# EAGLE design motor_controller (EAGLE 9.6.2)
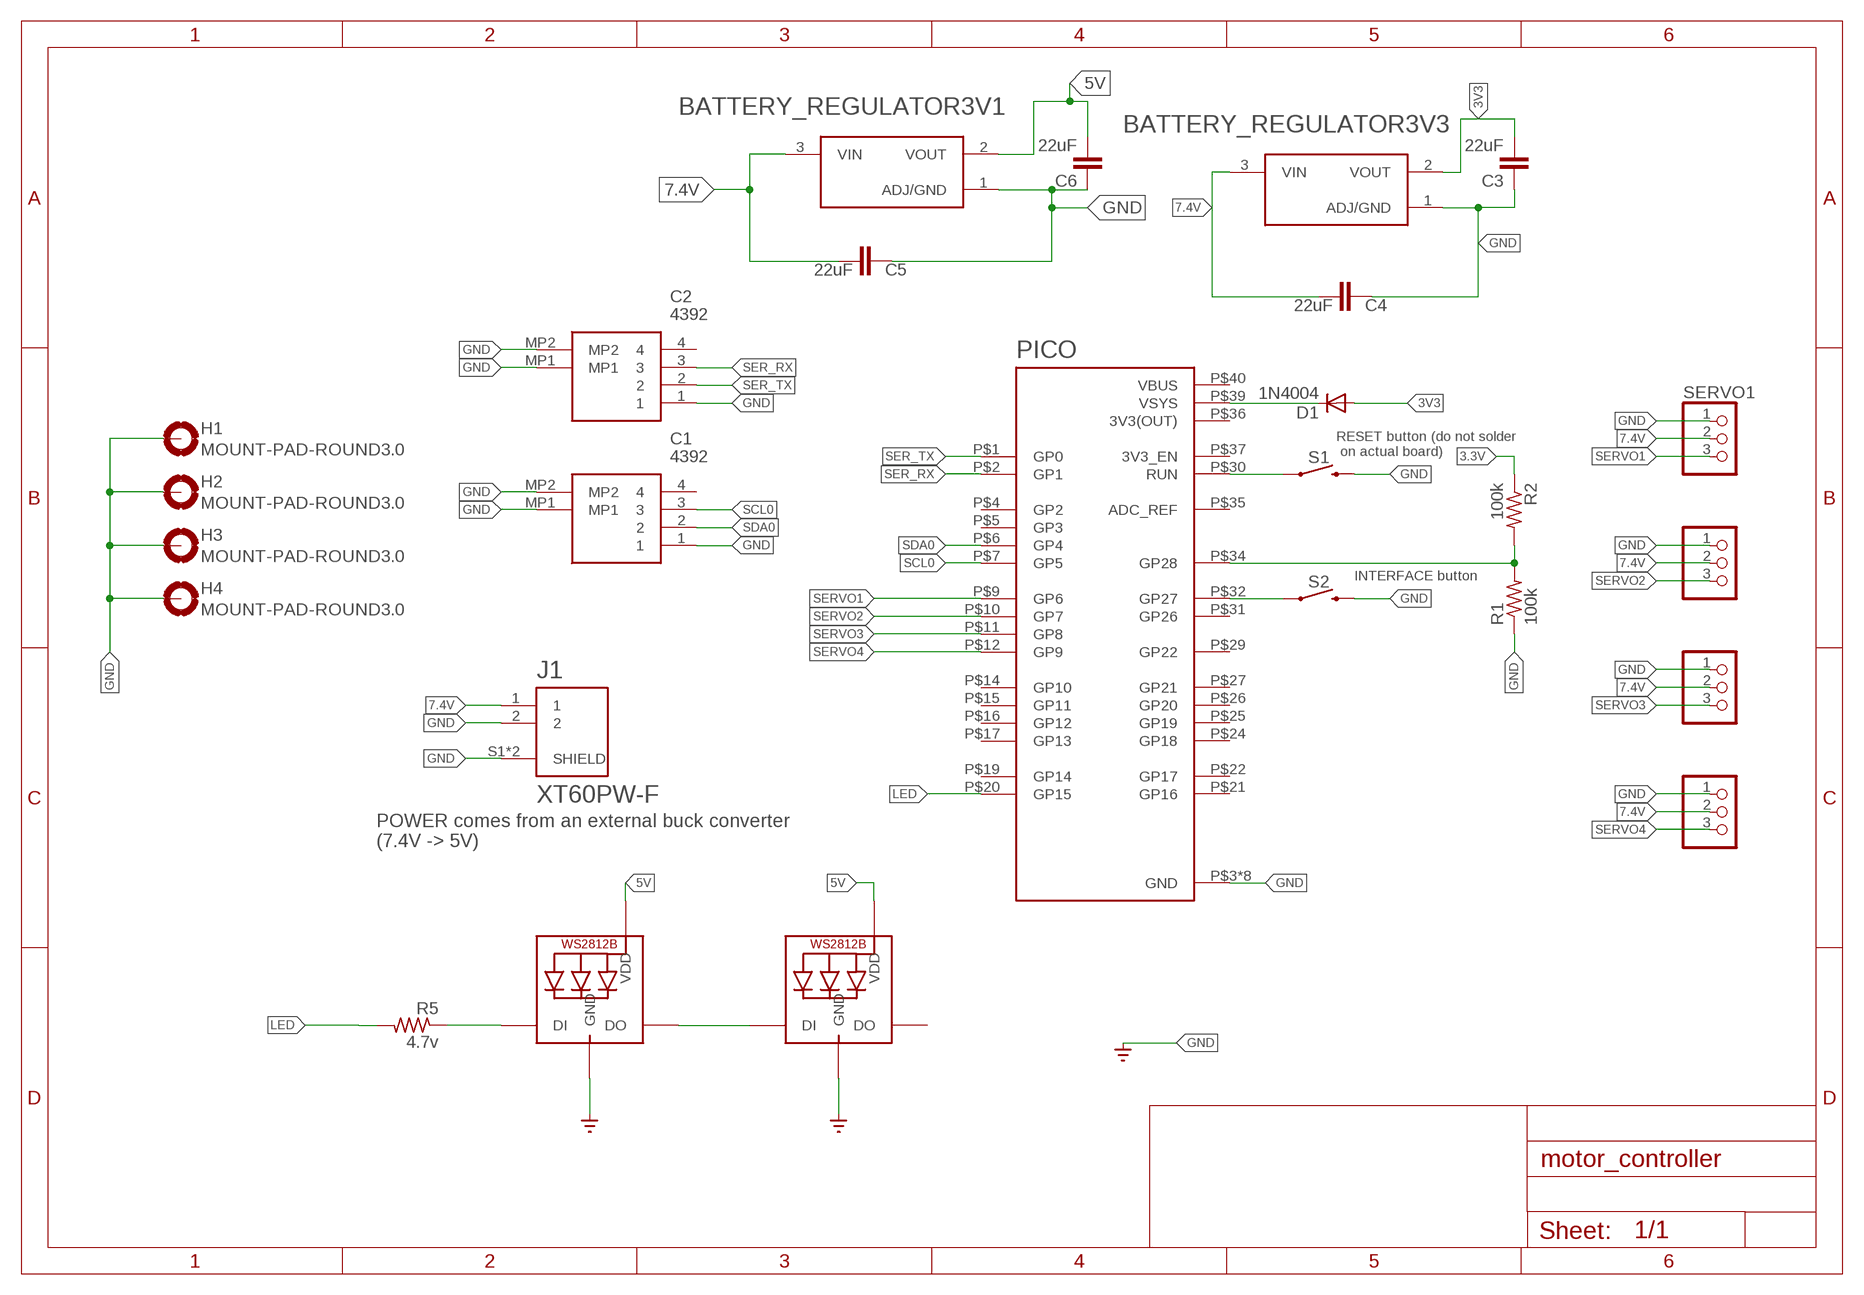
[diagram p0: schematic, sheet 1]

## Parts
BATTERY_REGULATOR3V1  AMS1117-3.3  [SOT229P700X180-4N]
BATTERY_REGULATOR3V3  AMS1117-3.3  [SOT229P700X180-4N]
C1  4392  [4392]
C2  4392  [4392]
C3  22uF  22UF-0805-6.3V-20%  [0805]
C4  22uF  22UF-0805-6.3V-20%  [0805]
C5  22uF  22UF-0805-6.3V-20%  [0805]
C6  22uF  22UF-0805-6.3V-20%  [0805]
D1  1N4004  [DO41-10]
H1  MOUNT-PAD-ROUND3.0  [3,0-PAD]
H2  MOUNT-PAD-ROUND3.0  [3,0-PAD]
H3  MOUNT-PAD-ROUND3.0  [3,0-PAD]
H4  MOUNT-PAD-ROUND3.0  [3,0-PAD]
J1  XT60PW-F  [AMASS_XT60PW-F]
LED1  WS2812B3535  [LED3535]
LED2  WS2812B3535  [LED3535]
PICO  RASPBERRY_PICO-NO_DEBUG  [PICO-PKG-NO_DEBUG]
R1  100k  R-US_R0805  [R0805]
R2  100k  R-US_R0805  [R0805]
R5  4.7v  R-US_R0805  [R0805]
S1  MOMENTARY-SWITCH-SPST-PTH-6.0MM  [TACTILE_SWITCH_PTH_6.0MM]
S2  MOMENTARY-SWITCH-SPST-PTH-6.0MM  [TACTILE_SWITCH_PTH_6.0MM]
SERVO1  PINHD-1X3  [1X03]
SERVO2  PINHD-1X3  [1X03]
SERVO3  PINHD-1X3  [1X03]
SERVO4  PINHD-1X3  [1X03]

## Nets
3.3V: R2.1
3V3: BATTERY_REGULATOR3V3.2(VOUT) C3.2 D1.A
5V: BATTERY_REGULATOR3V1.2(VOUT) C6.2 LED1.2(VDD) LED2.2(VDD)
7.4V: BATTERY_REGULATOR3V1.3(VIN) BATTERY_REGULATOR3V3.3(VIN) C4.2 C5.2 J1.1 SERVO1.2 SERVO2.2 SERVO3.2 SERVO4.2
GND: BATTERY_REGULATOR3V1.1(ADJ/GND) BATTERY_REGULATOR3V3.1(ADJ/GND) C1.1 C1.MP1 C1.MP2 C2.1 C2.MP1 C2.MP2 C3.1 C4.1 C5.1 C6.1 H1.B3,0(MOUNT) H2.B3,0(MOUNT) H3.B3,0(MOUNT) H4.B3,0(MOUNT) J1.2 J1.S1(SHIELD) J1.S2(SHIELD) LED1.4(GND) LED2.4(GND) PICO.P$3(GND) PICO.P$8(GND) PICO.P$13(GND) PICO.P$18(GND) PICO.P$23(GND) PICO.P$28(GND) PICO.P$33(GND) PICO.P$38(GND) R1.1 S1.3 S2.3 SERVO1.1 SERVO2.1 SERVO3.1 SERVO4.1 ; supply symbol labelled SUPPLY0_GND_
LED: PICO.P$20(GP15) R5.2
N$1: D1.C PICO.P$39(VSYS)
N$2: PICO.P$30(RUN) S1.1
N$3: PICO.P$32(GP27) S2.1
N$4: PICO.P$34(GP28) R1.2 R2.2
N$7: LED1.3(DO) LED2.1(DI)
N$8: LED1.1(DI) R5.1
SCL0: C1.3 PICO.P$7(GP5)
SDA0: C1.2 PICO.P$6(GP4)
SER_RX: C2.3 PICO.P$2(GP1)
SER_TX: C2.2 PICO.P$1(GP0)
SERVO1: PICO.P$9(GP6) SERVO1.3
SERVO2: PICO.P$10(GP7) SERVO2.3
SERVO3: PICO.P$11(GP8) SERVO3.3
SERVO4: PICO.P$12(GP9) SERVO4.3
Unconnected: C1.4 C2.4 LED2.3(DO) PICO.P$4(GP2) PICO.P$5(GP3) PICO.P$14(GP10) PICO.P$15(GP11) PICO.P$16(GP12) PICO.P$17(GP13) PICO.P$19(GP14) PICO.P$21(GP16) PICO.P$22(GP17) PICO.P$24(GP18) PICO.P$25(GP19) PICO.P$26(GP20) PICO.P$27(GP21) PICO.P$29(GP22) PICO.P$31(GP26) PICO.P$35(ADC_REF) PICO.P$37(3V3_EN)

## Notes on the sheet
- RESET button (do not solder
   on actual board)
- INTERFACE button
- POWER comes from an external buck converter 
  (7.4V -> 5V)

## Power pins joined to a net without a drawn wire
3V3(OUT): PICO.P$36(3V3(OUT))
VBUS: PICO.P$40(VBUS)

## Library data of the parts
BATTERY_REGULATOR3V1 BATTERY_REGULATOR3V3 = AMS1117-3.3:AMS1117-3.3: Sot223/Pkg 1-Amp 3.3-Volt Low Drop Out Voltage Regulatator Check availability <https://pricing.snapeda.com/parts/AMS1117-3.3/Advanced%20Monolithic%20Systems/view-part?ref=eda>; AVAILABILITY: Not in stock; DESCRIPTION: Sot223/Pkg 1-Amp 3.3-Volt Low Drop Out Voltage Regulatator; MF: Advanced Monolithic Systems; MP: AMS1117-3.3; PACKAGE: SOT-223 Seeed Technology; PRICE: None
C1 C2 = 4392:4392: Adafruit Accessories JST PH 4-pin Horizontal Connector (10-pack) - STEMMA Source: Datasheet <https://www.mouser.dk/datasheet/2/737/4389_C13924-001_CCP-W20-03-BK-SMT-R-A-1708610.pdf>; DESCRIPTION: Adafruit Accessories JST PH 4-pin Horizontal Connector (10-pack) - STEMMA; HEIGHT: 6.85mm; MANUFACTURER_NAME: Adafruit; MANUFACTURER_PART_NUMBER: 4392; MOUSER_PART_NUMBER: 485-4392; MOUSER_PRICE-STOCK: https://www.mouser.co.uk/ProductDetail/Adafruit/4392?qs=xZ%2FP%252Ba9zWqbG2TKb%252Bnxciw%3D%3D
C3-C6 = SparkFun-Capacitors:22UF: 22µF ceramic capacitors A capacitor is a passive two-terminal electrical component used to store electrical energy temporarily in an electric field.; PROD_ID: CAP-08402
D1 = adafruit:1N4004: DIODE General purpose 1N400x type rectifier (With bigger pads) http://www.ladyada.net/library/pcb/eaglelibrary.html
H1-H4 = holes:MOUNT-PAD-ROUND: MOUNTING PAD, round
J1 = XT60PW-F:XT60PW-F: Socket DC Supply Connector Female Check availability <https://pricing.snapeda.com/parts/XT60PW-F/AMASS/view-part?ref=eda>; AVAILABILITY: Not in stock; CHECK_PRICES: https://www.snapeda.com/parts/XT60PW-F/AMASS/view-part/?ref=eda; MF: AMASS; MP: XT60PW-F; PACKAGE: Package; PRICE: None; SNAPEDA_LINK: https://www.snapeda.com/parts/XT60PW-F/AMASS/view-part/?ref=snap
LED1 LED2 = WS2812B:WS2812B: Check availability <https://pricing.snapeda.com/parts/WS2812B/Worldsemi/view-part?ref=eda>; AVAILABILITY: Not in stock; CHECK_PRICES: https://www.snapeda.com/parts/WS2812B/Worldsemi/view-part/?ref=eda; DESCRIPTION: Intelligent control LED integrated light source; MF: Worldsemi; MP: WS2812B; PACKAGE: None; PRICE: None; SNAPEDA_LINK: https://www.snapeda.com/parts/WS2812B/Worldsemi/view-part/?ref=snap
PICO = RpiPico:RASPBERRY_PICO-NO_DEBUG
R1 R2 R5 = rcl:R-US_: RESISTOR, American symbol; SPICEPREFIX: R
S1 S2 = SparkFun-Switches:MOMENTARY-SWITCH-SPST: Momentary Switch (Pushbutton) - SPST Normally-open (NO) SPST momentary switches (buttons, pushbuttons). Variants PTH-12MM - 12mm square, through-hole Momentary Pushbutton Switch - 12mm Square <https://www.sparkfun.com/products/9190> (COM-09190) PTH-6.0MM, PTH-6.0MM-KIT - 6.0mm square, through-hole Mini Pushbutton Switch <https://www.sparkfun.com/products/97> (COM-00097) KIT package intended for soldering kit's - only one side of pads' copper is exposed. PTH-RIGHT-ANGLE-KIT - Right-angle, through-hole Right Angle Tactile Button <https://www.sparkfun.com/products/10791> - Used on SparkFun BigTime Watch Kit <https://www.sparkfun.com/products/11734> SMD-12MM - 12mm square, surface-mount Tactile Button - SMD (12mm) <https://www.sparkfun.com/products/12993> (COM-12993) Used on SparkFun PicoBoard <https://www.sparkfun.com/products/11888> SMD-4.5MM - 4.5mm Square Trackball Switch Used on SparkFun Blackberry Trackballer Breakout <https://www.sparkfun.com/products/13169> SMD-4.6MMX2.8MM - 4.60mm x 2.80mm, surface mount Used on SparkFun Pro Micro - RP2040 <https://www.sparkfun.com/products/17717> SMD-5.2MM, SMD-5.2-REDUNDANT - 5.2mm square, surface-mount Mini Pushbutton Switch - SMD <https://www.sparkfun.com/products/8720> (COM-08720) Used on Arduino Pro Mini <https://www.sparkfun.com/products/11114> REDUNDANT package connects both switch circuits together SMD-6.0X3.5MM - 6.0 x 3.5mm, surface mount Momentary Reset Switch SMD <https://www.sparkfun.com/products/8229> (COM-08229) SMD-6.2MM-TALL - 6.2mm square, surface mount Tactile Button - SMD (6mm) <https://www.sparkfun.com/products/12992> Used on SparkFun Digital Sandbox <https://www.sparkfun.com/products/12651> SMD-RIGHT-ANGLE - Right-angle, surface mount Used on SparkFun Block for Intel® Edison - Arduino <https://www.sparkfun.com/products/13036>; PROD_ID: SWCH-08441; SF_SKU: COM-00097
SERVO1-SERVO4 = pinhead:PINHD-1X3: PIN HEADER

## Board
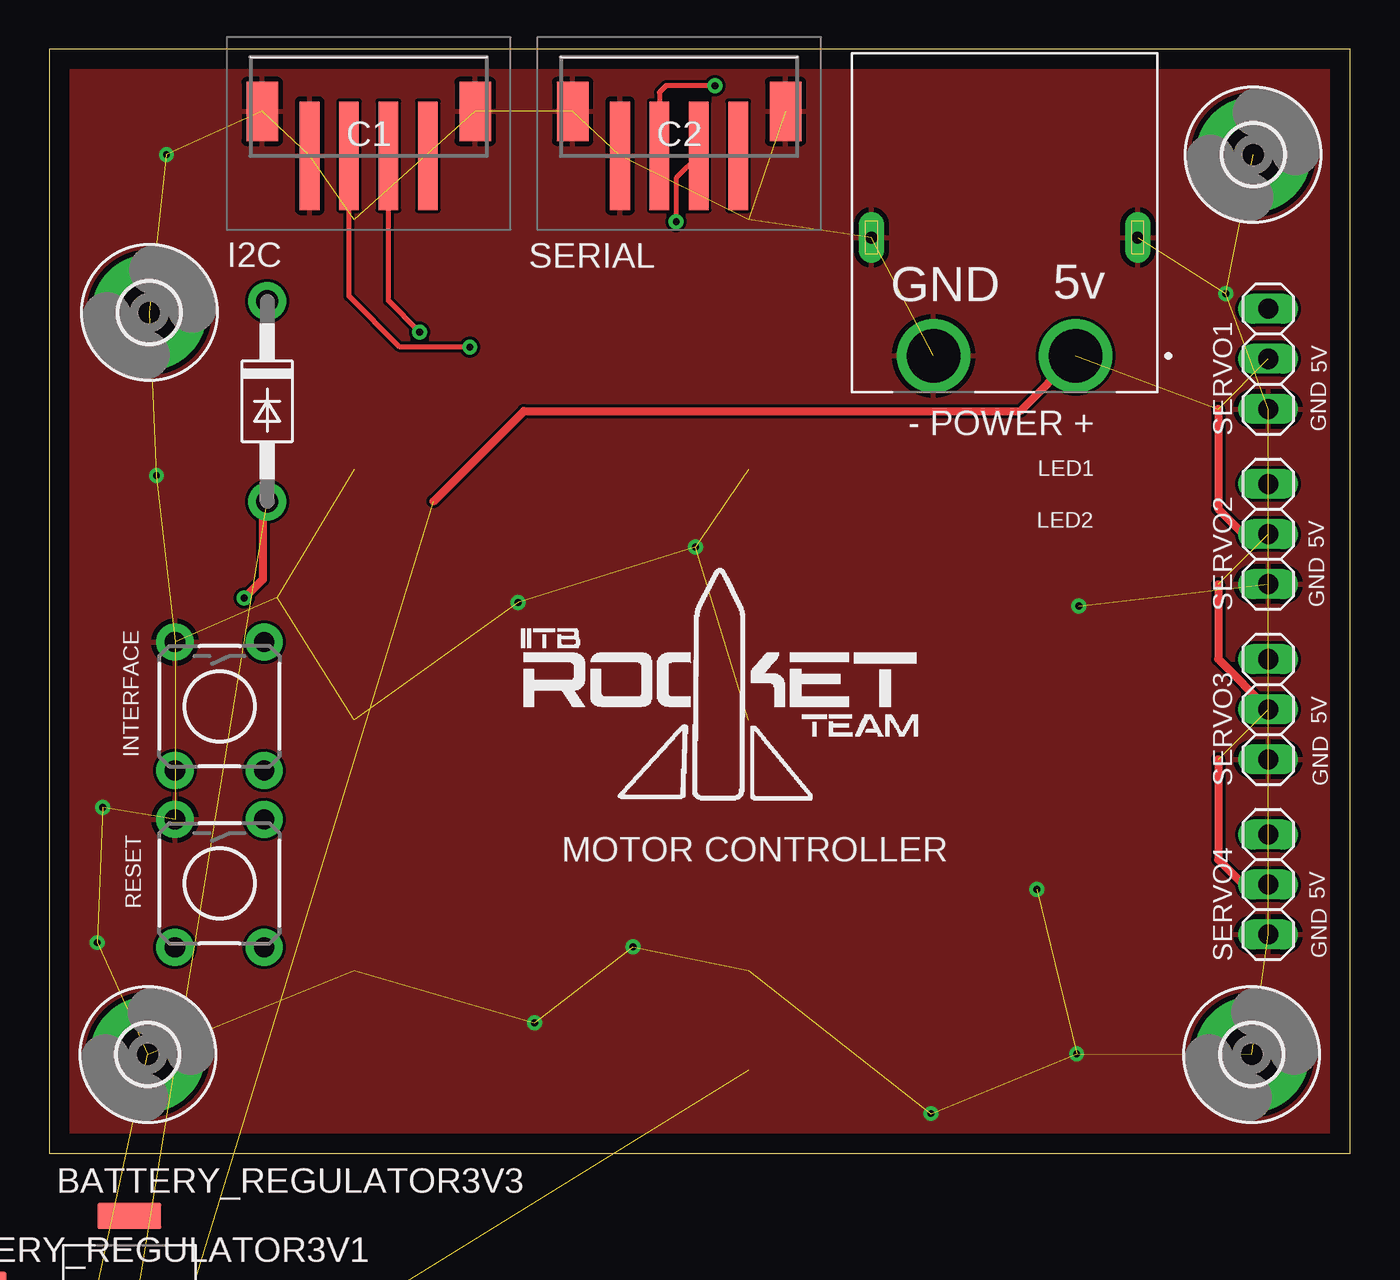
[diagram p1: board, top side]
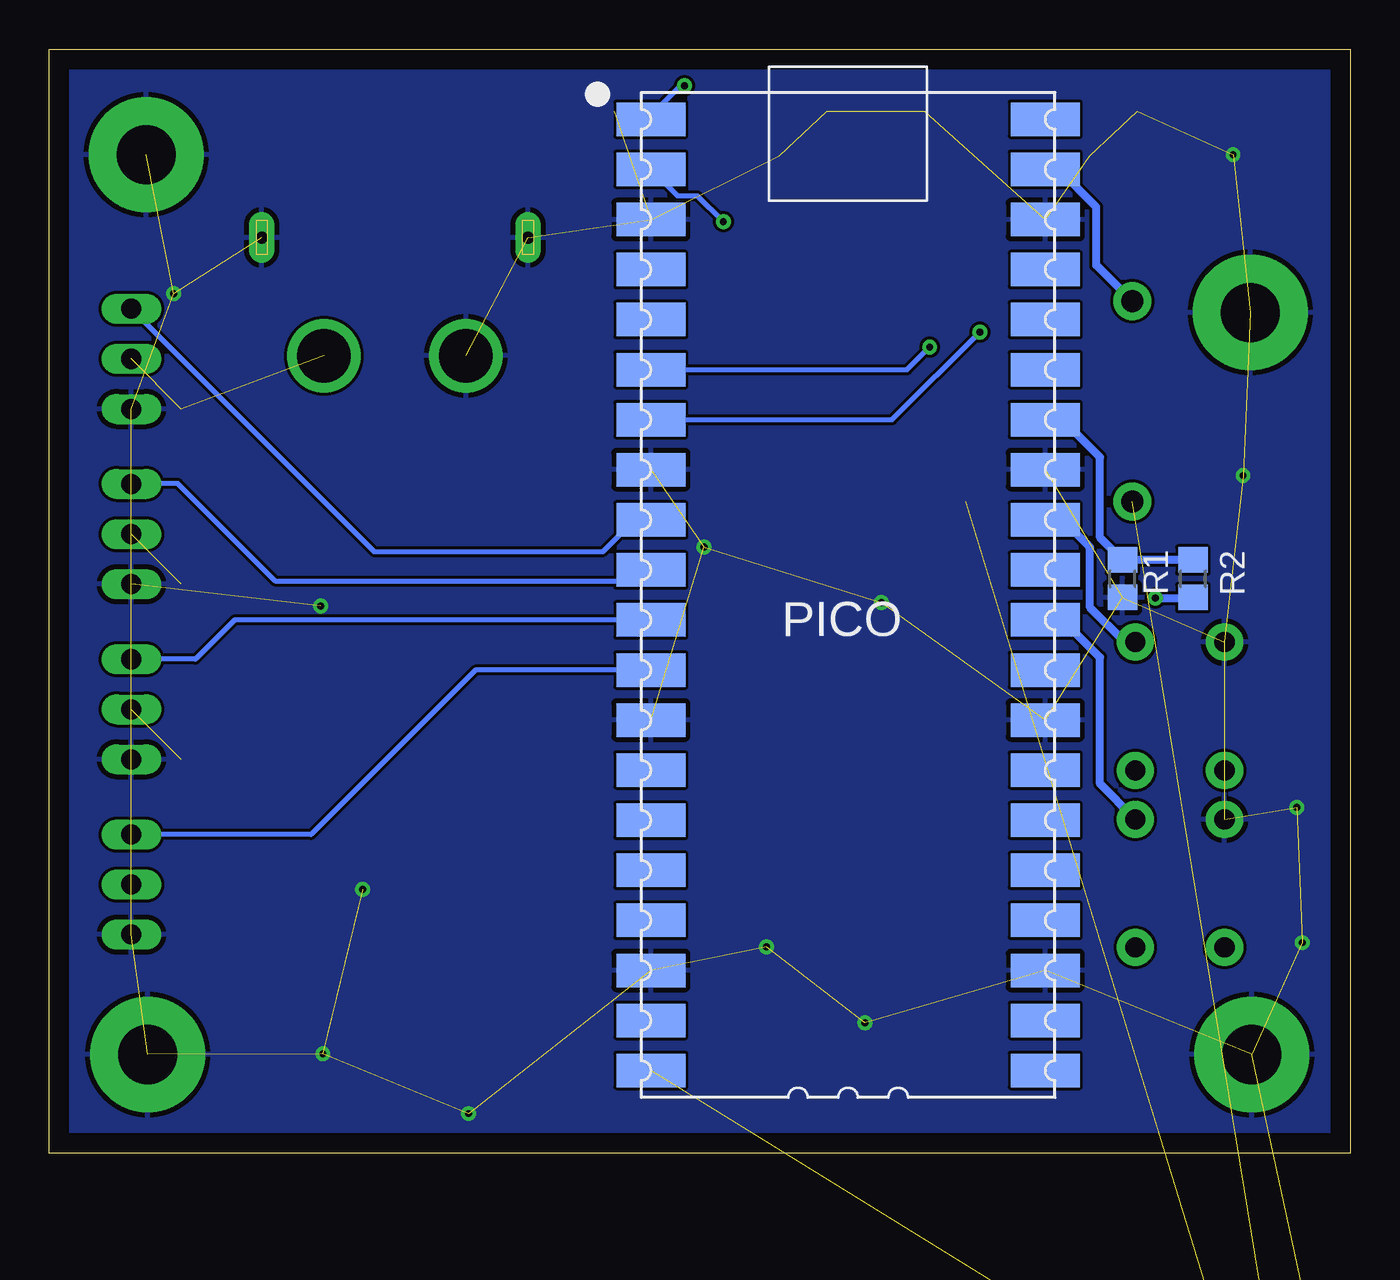
[diagram p2: board, bottom side, seen from below]

Size 66 x 56 mm. Coordinates in mm from the lower left corner, seen from the top.
Outline: 0,0 66,0 66,56 0,56 0,0
Copper layers (1*16): Top 0.035mm / dielectric 1.5mm / Bottom 0.035mm
Design rules "default": minimum track width 6mil, minimum drill 0.35mm, track to track 6mil, track to pad 6mil, pad to pad 6mil, via to via 6mil, smd to smd 6mil, copper to edge 40mil, drill to drill 6mil, minimum pad ring 10mil, minimum via ring 8mil, stop-mask expansion 4mil, vias tented up to drill 0mil, thermal gap 10mil

### Footprints (pad centres in the part's own frame; a part is rotated, then mirrored left to right if it is on the bottom)
SOT229P700X180-4N = smd 0.93 x 1.31: 1 -2.29,-3.345; 2 0,-3.345; 3 2.29,-3.345 | smd 3.24 x 1.31: 4 0,3.345
4392 = smd 1 x 5.5: 1 3,3.5; 2 1,3.5; 3 -1,3.5; 4 -3,3.5 | smd 1.6 x 3: MP1 5.4,1.25; MP2 -5.4,1.25
0805 = smd 0.8 x 1.2: 1 -0.9,0; 2 0.9,0
DO41-10 = drill 1.118 pad 1.93: A 5.08,0; C -5.08,0
3,0-PAD = drill 3 pad 5.842: B3,0 0,0
AMASS_XT60PW-F = drill 2.7: 1 -3.6,0; 2 3.6,0 | drill 0.6 pad 1.3 long: S1 -6.75,-6; S2 6.75,-6
LED3535 = smd 1 x 0.85: 1 -1.75,0.875; 2 -1.75,-0.875; 3 1.75,-0.875; 4 1.75,0.875
PICO-PKG-NO_DEBUG = smd 3.5 x 1.7: P$1 -8.73,25.4; P$2 -8.73,22.86; P$3 -8.73,20.32; P$4 -8.73,17.78; P$5 -8.73,15.24; P$6 -8.73,12.7; P$7 -8.73,10.16; P$8 -8.73,7.62; P$9 -8.73,5.08; P$10 -8.73,2.54; P$11 -8.73,0; P$12 -8.73,-2.54; P$13 -8.73,-5.08; P$14 -8.73,-7.62; P$15 -8.73,-10.16; P$16 -8.73,-12.7; P$17 -8.73,-15.24; P$18 -8.73,-17.78; P$19 -8.73,-20.32; P$20 -8.73,-22.86; P$21 11.27,-22.86; P$22 11.27,-20.32; P$23 11.27,-17.78; P$24 11.27,-15.24; P$25 11.27,-12.7; P$26 11.27,-10.16; P$27 11.27,-7.62; P$28 11.27,-5.08; P$29 11.27,-2.54; P$30 11.27,0; P$31 11.27,2.54; P$32 11.27,5.08; P$33 11.27,7.62; P$34 11.27,10.16; P$35 11.27,12.7; P$36 11.27,15.24; P$37 11.27,17.78; P$38 11.27,20.32; P$39 11.27,22.86; P$40 11.27,25.4
R0805 = smd 1.3 x 1.5: 1 -0.95,0; 2 0.95,0
TACTILE_SWITCH_PTH_6.0MM = drill 1.016 pad 1.88: 1 -3.251,2.261; 2 3.251,2.261; 3 -3.251,-2.261; 4 3.251,-2.261
1X03 = drill 1.016 long: 1 -2.54,0; 2 0,0; 3 2.54,0

### Placement (x,y rotation side)
BATTERY_REGULATOR3V1  -3.78,-10.03 0 top  (outside the outline)
BATTERY_REGULATOR3V3  4.06,-6.53 0 top  (outside the outline)
C1  16.21,54.1 180 top
C2  31.95,54.1 180 top
C3  13.44,-15.01 0 top  (outside the outline)
C4  16.51,-15.01 0 top  (outside the outline)
C5  -6.2,-18.52 0 top  (outside the outline)
C6  -6.2,-22.02 0 top  (outside the outline)
D1  11.05,38.14 270 top
H1  5.08,42.65 0 top
H2  5,5 0 top
H3  61,5 0 top
H4  61.08,50.65 0 top
J1  48.46,40.45 180 top
LED1  -10.44,-20.68 0 top  (outside the outline)
LED2  -15.29,-20.68 0 top  (outside the outline)
PICO  26.75,27.05 0 bottom
R1  11.56,29.14 90 bottom
R2  7.98,29.14 90 bottom
R5  -15.7,-26.82 0 top  (outside the outline)
S1  8.64,13.69 270 top
S2  8.64,22.67 270 top
SERVO1  61.84,40.29 90 top
SERVO2  61.84,31.4 90 top
SERVO3  61.84,22.51 90 top
SERVO4  61.84,13.62 90 top

### Tracks (layer width: path | path; a pad name or v marks a point on that pad's centre or on a via)
3.3V  (via drill 0.35)
  Top 0.406: 10.83,32.83 10.83,29.1 v9.88,28.15
  Bottom 0.406: v9.88,28.15 8.02,28.15 R2.1
3V3  (2 unrouted)
5V  (3 unrouted)
7.4V  (8 unrouted)
  Top 0.406: 19.49,33.06 24.08,37.65 49.26,37.65 J1.1 | 61.68,40.45 SERVO1.2 | SERVO2.2 60.57,31.4 59.3,32.67 59.3,37.75 | 59.3,28.86 59.3,25.05 SERVO3.2 | 59.3,19.97 59.3,14.89 60.57,13.62 SERVO4.2
GND  (via drill 0.35)  (48 unrouted)
  other vias: 5.94,50.64 5.44,34.36 2.72,17.54 23.77,27.94 29.62,10.46 2.44,10.68 24.61,6.6 32.78,30.74 44.73,2 52.12,5.03 52.24,27.75 50.1,13.38 59.69,43.61
  pour Bottom: 0,56.03 0,0 65.99,0 65.99,56.03
  pour Top: 0,56.03 0,0 65.99,0 65.99,56.03
LED  (1 unrouted)
N$1
  Bottom 0.406: D1.C 12.88,45.05 12.88,48 14.79,49.91 PICO.P$39
N$2
  Bottom 0.406: S1.1 12.7,18.74 12.7,25.15 14.6,27.05 PICO.P$30
N$3
  Bottom 0.406: S2.1 11.44,25.92 13.21,27.69 13.21,30.73 14.6,32.13 PICO.P$32
N$4
  Bottom 0.406: R2.2 R1.2 12.7,31.24 12.7,35.31 14.6,37.21 PICO.P$34
N$7  (1 unrouted)
N$8  (1 unrouted)
SCL0  (via drill 0.35)
  Top 0.254: v18.8,41.66 17.2,43.25 C1.3
  Bottom 0.254: PICO.P$7 23.25,37.21 v18.8,41.66
SDA0  (via drill 0.35)
  Top 0.254: v21.34,40.89 17.78,40.89 15.21,43.47 C1.2
  Bottom 0.254: PICO.P$6 22.48,39.75 v21.34,40.89
SER_RX  (via drill 0.35)
  Top 0.254: C2.3 31.81,49.45 v31.81,47.24
  Bottom 0.254: PICO.P$2 34.13,48.56 33.13,48.56 v31.81,47.24
SER_TX  (via drill 0.35)
  Top 0.254: v33.78,54.15 31.29,54.15 30.95,53.81 C2.2
  Bottom 0.254: PICO.P$1 35.48,52.66 33.78,54.36 v33.78,54.15
SERVO1
  Bottom 0.254: SERVO1.3 49.51,30.5 37.92,30.5 36.3,32.13 PICO.P$9
SERVO2
  Bottom 0.254: SERVO2.3 61.81,33.97 59.47,33.97 54.5,29 36.06,29 PICO.P$10
SERVO3
  Bottom 0.254: SERVO3.3 58.59,25.05 56.59,27.05 PICO.P$11
SERVO4
  Bottom 0.254: SERVO4.3 52.72,16.16 44.38,24.51 PICO.P$12

### Text on the board
tNames: I2C | SERIAL | GND | 5v | 5V | - POWER + | GND | LED1 | LED2 | 5V | GND | 5V | INTERFACE | GND | MOTOR CONTROLLER | 5V | RESET | GND